# Altium schematic sheet Sheet3.SCHDOC
size 593 x 439 mm; DocumentNumber: ЕМС.02.00.100 Э3; SheetNumber: 3; SheetTotal: 4; DocumentName: Sheet3.SCHDOC
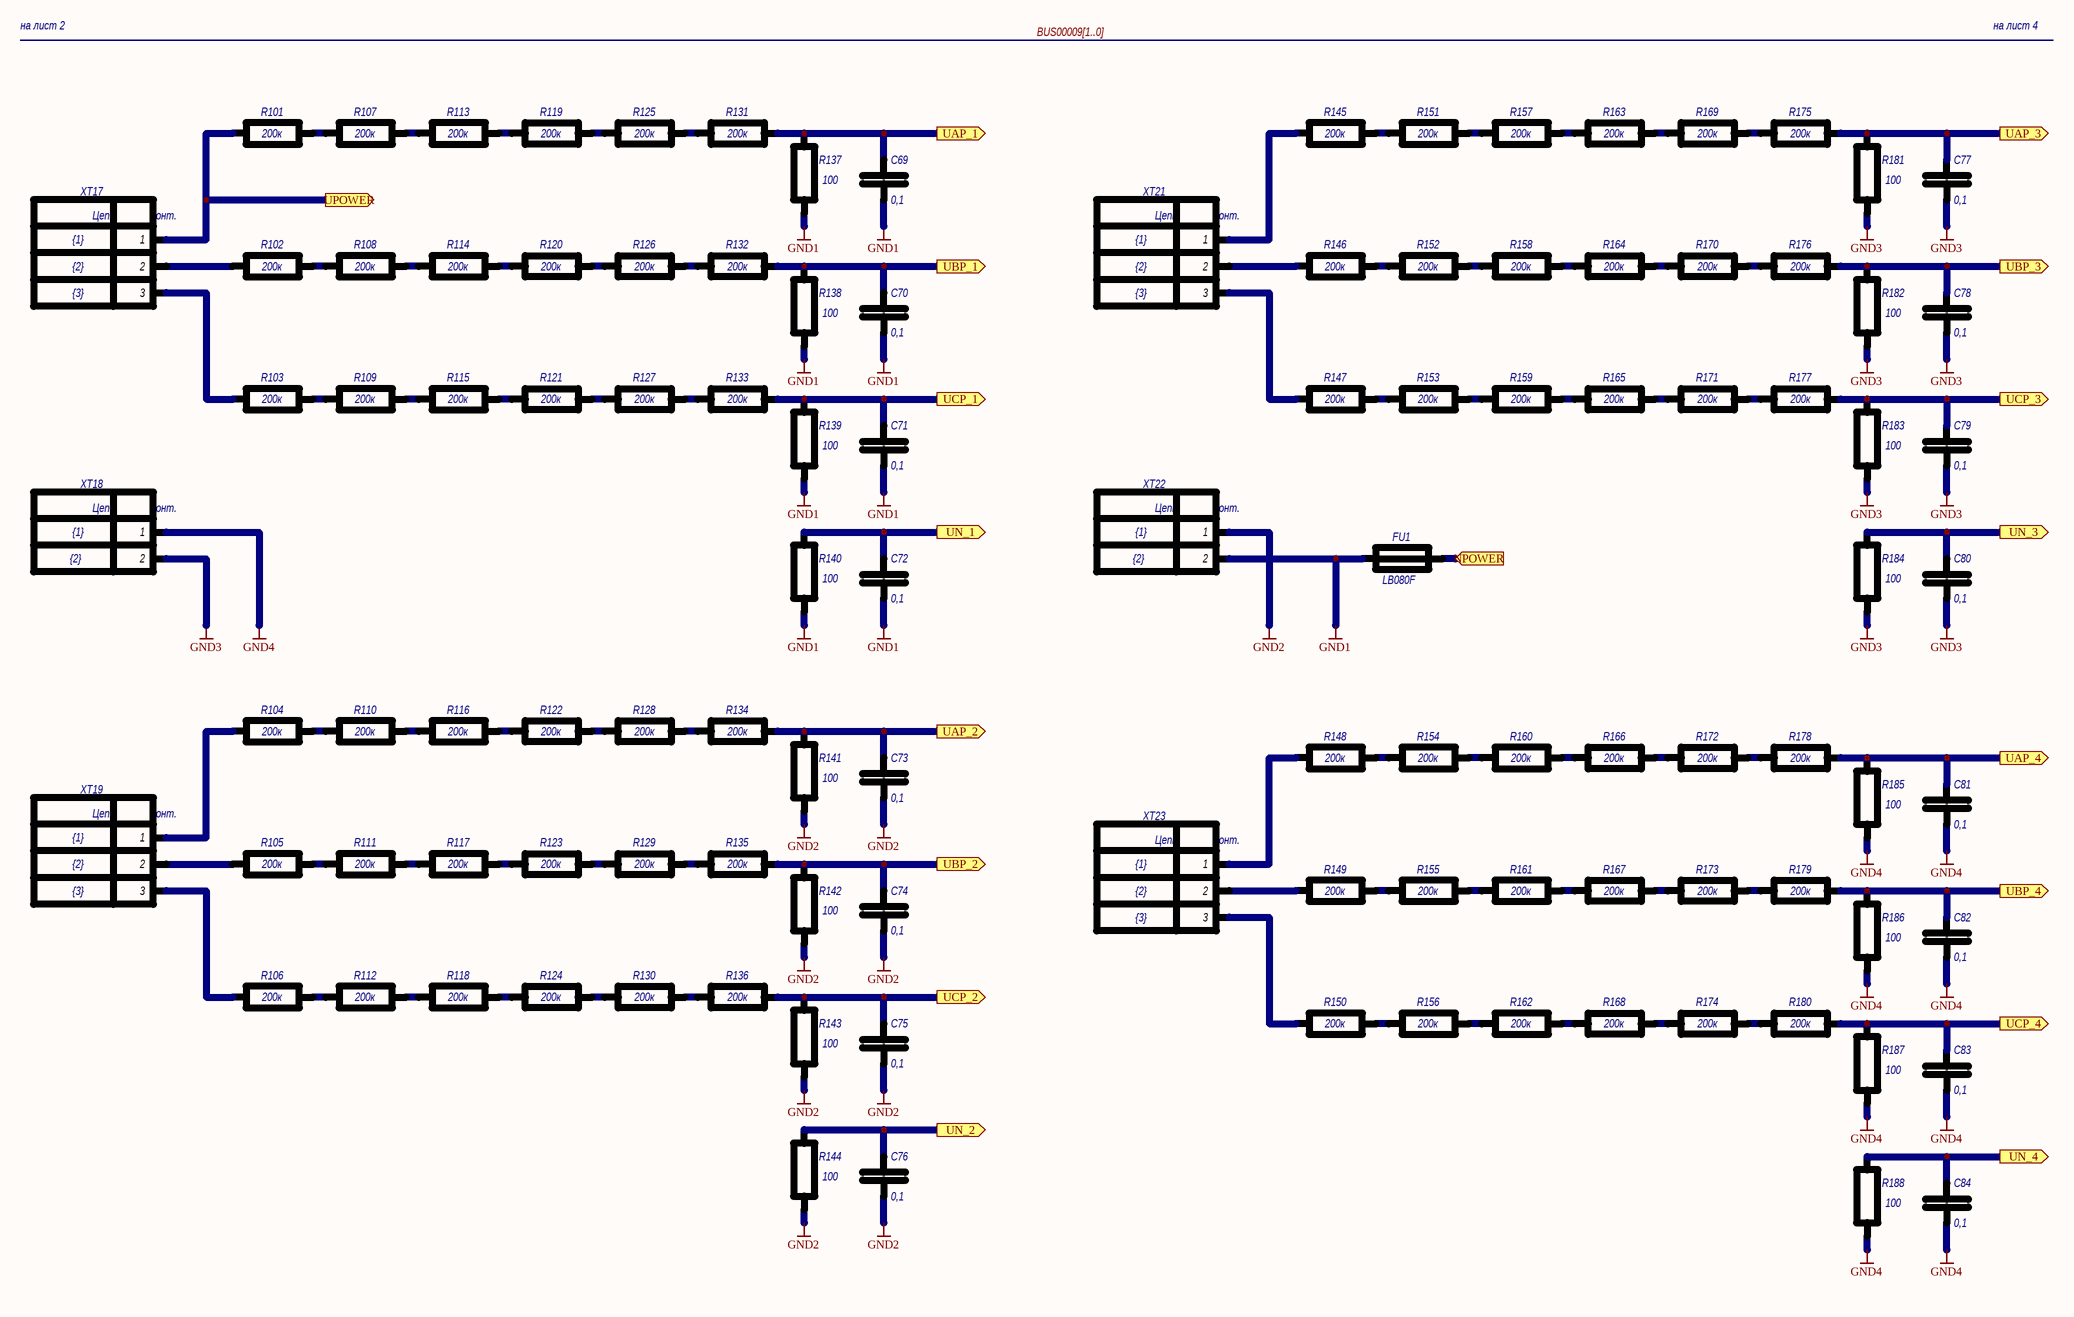
[diagram p0: Sheet3.SCHDOC]

## Parts
C69  value 0,1  [0805]  (hidden comment: К0805)
C70  value 0,1  [0805]  (hidden comment: К0805)
C71  value 0,1  [0805]  (hidden comment: К0805)
C72  value 0,1  [0805]  (hidden comment: К0805)
C73  value 0,1  [0805]  (hidden comment: К0805)
C74  value 0,1  [0805]  (hidden comment: К0805)
C75  value 0,1  [0805]  (hidden comment: К0805)
C76  value 0,1  [0805]  (hidden comment: К0805)
C77  value 0,1  [0805]  (hidden comment: К0805)
C78  value 0,1  [0805]  (hidden comment: К0805)
C79  value 0,1  [0805]  (hidden comment: К0805)
C80  value 0,1  [0805]  (hidden comment: К0805)
C81  value 0,1  [0805]  (hidden comment: К0805)
C82  value 0,1  [0805]  (hidden comment: К0805)
C83  value 0,1  [0805]  (hidden comment: К0805)
C84  value 0,1  [0805]  (hidden comment: К0805)
FU1  LB080F  [LB080F]
R101  Р1206  [1206]  (value not drawn)
R102  Р1206  [1206]  (value not drawn)
R103  Р1206  [1206]  (value not drawn)
R104  Р1206  [1206]  (value not drawn)
R105  Р1206  [1206]  (value not drawn)
R106  Р1206  [1206]  (value not drawn)
R107  Р1206  [1206]  (value not drawn)
R108  Р1206  [1206]  (value not drawn)
R109  Р1206  [1206]  (value not drawn)
R110  Р1206  [1206]  (value not drawn)
R111  Р1206  [1206]  (value not drawn)
R112  Р1206  [1206]  (value not drawn)
R113  Р1206  [1206]  (value not drawn)
R114  Р1206  [1206]  (value not drawn)
R115  Р1206  [1206]  (value not drawn)
R116  Р1206  [1206]  (value not drawn)
R117  Р1206  [1206]  (value not drawn)
R118  Р1206  [1206]  (value not drawn)
R119  Р1206  [1206]  (value not drawn)
R120  Р1206  [1206]  (value not drawn)
R121  Р1206  [1206]  (value not drawn)
R122  Р1206  [1206]  (value not drawn)
R123  Р1206  [1206]  (value not drawn)
R124  Р1206  [1206]  (value not drawn)
R125  Р1206  [1206]  (value not drawn)
R126  Р1206  [1206]  (value not drawn)
R127  Р1206  [1206]  (value not drawn)
R128  Р1206  [1206]  (value not drawn)
R129  Р1206  [1206]  (value not drawn)
R130  Р1206  [1206]  (value not drawn)
R131  Р1206  [1206]  (value not drawn)
R132  Р1206  [1206]  (value not drawn)
R133  Р1206  [1206]  (value not drawn)
R134  Р1206  [1206]  (value not drawn)
R135  Р1206  [1206]  (value not drawn)
R136  Р1206  [1206]  (value not drawn)
R137  value 100  [0805]  (hidden comment: Р0805)
R138  value 100  [0805]  (hidden comment: Р0805)
R139  value 100  [0805]  (hidden comment: Р0805)
R140  value 100  [0805]  (hidden comment: Р0805)
R141  value 100  [0805]  (hidden comment: Р0805)
R142  value 100  [0805]  (hidden comment: Р0805)
R143  value 100  [0805]  (hidden comment: Р0805)
R144  value 100  [0805]  (hidden comment: Р0805)
R145  Р1206  [1206]  (value not drawn)
R146  Р1206  [1206]  (value not drawn)
R147  Р1206  [1206]  (value not drawn)
R148  Р1206  [1206]  (value not drawn)
R149  Р1206  [1206]  (value not drawn)
R150  Р1206  [1206]  (value not drawn)
R151  Р1206  [1206]  (value not drawn)
R152  Р1206  [1206]  (value not drawn)
R153  Р1206  [1206]  (value not drawn)
R154  Р1206  [1206]  (value not drawn)
R155  Р1206  [1206]  (value not drawn)
R156  Р1206  [1206]  (value not drawn)
R157  Р1206  [1206]  (value not drawn)
R158  Р1206  [1206]  (value not drawn)
R159  Р1206  [1206]  (value not drawn)
R160  Р1206  [1206]  (value not drawn)
R161  Р1206  [1206]  (value not drawn)
R162  Р1206  [1206]  (value not drawn)
R163  Р1206  [1206]  (value not drawn)
R164  Р1206  [1206]  (value not drawn)
R165  Р1206  [1206]  (value not drawn)
R166  Р1206  [1206]  (value not drawn)
R167  Р1206  [1206]  (value not drawn)
R168  Р1206  [1206]  (value not drawn)
R169  Р1206  [1206]  (value not drawn)
R170  Р1206  [1206]  (value not drawn)
R171  Р1206  [1206]  (value not drawn)
R172  Р1206  [1206]  (value not drawn)
R173  Р1206  [1206]  (value not drawn)
R174  Р1206  [1206]  (value not drawn)
R175  Р1206  [1206]  (value not drawn)
R176  Р1206  [1206]  (value not drawn)
R177  Р1206  [1206]  (value not drawn)
R178  Р1206  [1206]  (value not drawn)
R179  Р1206  [1206]  (value not drawn)
R180  Р1206  [1206]  (value not drawn)
R181  value 100  [0805]  (hidden comment: Р0805)
R182  value 100  [0805]  (hidden comment: Р0805)
R183  value 100  [0805]  (hidden comment: Р0805)
R184  value 100  [0805]  (hidden comment: Р0805)
R185  value 100  [0805]  (hidden comment: Р0805)
R186  value 100  [0805]  (hidden comment: Р0805)
R187  value 100  [0805]  (hidden comment: Р0805)
R188  value 100  [0805]  (hidden comment: Р0805)
XT17  2: {2}  1: {1}  3: {3}  [EK508V-03P]  (hidden comment: EK508V-03P)
XT18  2: {2}  1: {1}  [EK508V-02P]  (hidden comment: EK508V-02P)
XT19  2: {2}  1: {1}  3: {3}  [EK508V-03P]  (hidden comment: EK508V-03P)
XT21  2: {2}  1: {1}  3: {3}  [EK508V-03P]  (hidden comment: EK508V-03P)
XT22  2: {2}  1: {1}  [EK508V-02P]  (hidden comment: EK508V-02P)
XT23  2: {2}  1: {1}  3: {3}  [EK508V-03P]  (hidden comment: EK508V-03P)

## Ports
NPOWER (in), UAP_1 (out), UAP_2 (out), UAP_3 (out), UAP_4 (out), UBP_1 (out), UBP_2 (out), UBP_3 (out), UBP_4 (out), UCP_1 (out), UCP_2 (out), UCP_3 (out), UCP_4 (out), UN_1 (out), UN_2 (out), UN_3 (out), UN_4 (out), UPOWER (out)

## Nets
GND1: C69.1 C70.1 C71.1 C72.1 FU1.1 R137.1 R138.1 R139.1 R140.1 XT22.2
GND2: C73.1 C74.1 C75.1 C76.1 R141.1 R142.1 R143.1 R144.1 XT22.1
GND3: C77.1 C78.1 C79.1 C80.1 R181.1 R182.1 R183.1 R184.1 XT18.2
GND4: C81.1 C82.1 C83.1 C84.1 R185.1 R186.1 R187.1 R188.1 XT18.1
NPOWER: FU1.2 ; port NPOWER
UAP_1: C69.2 R131.1 R137.2 ; port UAP_1
UAP_2: C73.2 R134.1 R141.2 ; port UAP_2
UAP_3: C77.2 R175.1 R181.2 ; port UAP_3
UAP_4: C81.2 R178.1 R185.2 ; port UAP_4
UBP_1: C70.2 R132.1 R138.2 ; port UBP_1
UBP_2: C74.2 R135.1 R142.2 ; port UBP_2
UBP_3: C78.2 R176.1 R182.2 ; port UBP_3
UBP_4: C82.2 R179.1 R186.2 ; port UBP_4
UCP_1: C71.2 R133.1 R139.2 ; port UCP_1
UCP_2: C75.2 R136.1 R143.2 ; port UCP_2
UCP_3: C79.2 R177.1 R183.2 ; port UCP_3
UCP_4: C83.2 R180.1 R187.2 ; port UCP_4
UN_1: C72.2 R140.2 ; port UN_1
UN_2: C76.2 R144.2 ; port UN_2
UN_3: C80.2 R184.2 ; port UN_3
UN_4: C84.2 R188.2 ; port UN_4
UPOWER: R101.1 XT17.1 ; port UPOWER
NetR101_2: R101.2 R107.1
NetR102_1: R102.1 XT17.2
NetR102_2: R102.2 R108.1
NetR103_1: R103.1 XT17.3
NetR103_2: R103.2 R109.1
NetR104_1: R104.1 XT19.1
NetR104_2: R104.2 R110.1
NetR105_1: R105.1 XT19.2
NetR105_2: R105.2 R111.1
NetR106_1: R106.1 XT19.3
NetR106_2: R106.2 R112.1
NetR107_2: R107.2 R113.1
NetR108_2: R108.2 R114.1
NetR109_2: R109.2 R115.1
NetR110_2: R110.2 R116.1
NetR111_2: R111.2 R117.1
NetR112_2: R112.2 R118.1
NetR113_2: R113.2 R119.2
NetR114_2: R114.2 R120.2
NetR115_2: R115.2 R121.2
NetR116_2: R116.2 R122.2
NetR117_2: R117.2 R123.2
NetR118_2: R118.2 R124.2
NetR119_1: R119.1 R125.2
NetR120_1: R120.1 R126.2
NetR121_1: R121.1 R127.2
NetR122_1: R122.1 R128.2
NetR123_1: R123.1 R129.2
NetR124_1: R124.1 R130.2
NetR125_1: R125.1 R131.2
NetR126_1: R126.1 R132.2
NetR127_1: R127.1 R133.2
NetR128_1: R128.1 R134.2
NetR129_1: R129.1 R135.2
NetR130_1: R130.1 R136.2
NetR145_1: R145.1 XT21.1
NetR145_2: R145.2 R151.1
NetR146_1: R146.1 XT21.2
NetR146_2: R146.2 R152.1
NetR147_1: R147.1 XT21.3
NetR147_2: R147.2 R153.1
NetR148_1: R148.1 XT23.1
NetR148_2: R148.2 R154.1
NetR149_1: R149.1 XT23.2
NetR149_2: R149.2 R155.1
NetR150_1: R150.1 XT23.3
NetR150_2: R150.2 R156.1
NetR151_2: R151.2 R157.1
NetR152_2: R152.2 R158.1
NetR153_2: R153.2 R159.1
NetR154_2: R154.2 R160.1
NetR155_2: R155.2 R161.1
NetR156_2: R156.2 R162.1
NetR157_2: R157.2 R163.2
NetR158_2: R158.2 R164.2
NetR159_2: R159.2 R165.2
NetR160_2: R160.2 R166.2
NetR161_2: R161.2 R167.2
NetR162_2: R162.2 R168.2
NetR163_1: R163.1 R169.2
NetR164_1: R164.1 R170.2
NetR165_1: R165.1 R171.2
NetR166_1: R166.1 R172.2
NetR167_1: R167.1 R173.2
NetR168_1: R168.1 R174.2
NetR169_1: R169.1 R175.2
NetR170_1: R170.1 R176.2
NetR171_1: R171.1 R177.2
NetR172_1: R172.1 R178.2
NetR173_1: R173.1 R179.2
NetR174_1: R174.1 R180.2

## Buses and harness runs
bus BUS00009[1..0]

## Notes on the sheet
- на лист 2
- на лист 4
- Подп. и дата
- Инв. № дубл.
- Взам. инв. №
- Инв. № подл.
- Лист
- Изм.
- № докум.
- Подп.
- Дата
- (in symbol EK508V-02P) Цепь; Конт.
- (in symbol EK508V-03P) Цепь; Конт.
- (in symbol Р1206) 200к

## Library data of the parts
C69-C84 = К0805: КОНДЕНСАТОР; TG: NP0; TO: 5%; TU: {TU}; NO: {NO}; RefDes2: {RefDes2}; ComponentHeight: 1
FU1 = LB080F: {Description}; TU: {TU}; TG: {TG}; RefDes2: {RefDes2}; TO: {TO}; NO: {NO}; ComponentHeight: {ComponentHeight}
R101-R136 R145-R180 = Р1206: РЕЗИСТОР; TG: 0,25; TO: 5%; TU: {TU}; NO: {NO}; RefDes2: {RefDes2}; ComponentHeight: 1.2
R137-R144 R181-R188 = Р0805_VARIANT_1: РЕЗИСТОР; TG: 0,125; TO: 1%; TU: {TU}; NO: {NO}; RefDes2: {RefDes2}; ComponentHeight: 1
XT17 XT19 XT21 XT23 = EK508V-03P: {Description}; Value: 5.08; TU: {TU}; TG: {TG}; TO: {TO}; NO: {NO}; RefDes2: {RefDes2}; N1: {N1}; N2: {N2}; N3: {N3}; ComponentHeight: {ComponentHeight}
XT18 XT22 = EK508V-02P: {Description}; Value: 5.08; TU: {TU}; TG: {TG}; RefDes2: {RefDes2}; TO: {TO}; NO: {NO}; N1: {N1}; N2: {N2}; ComponentHeight: {ComponentHeight}